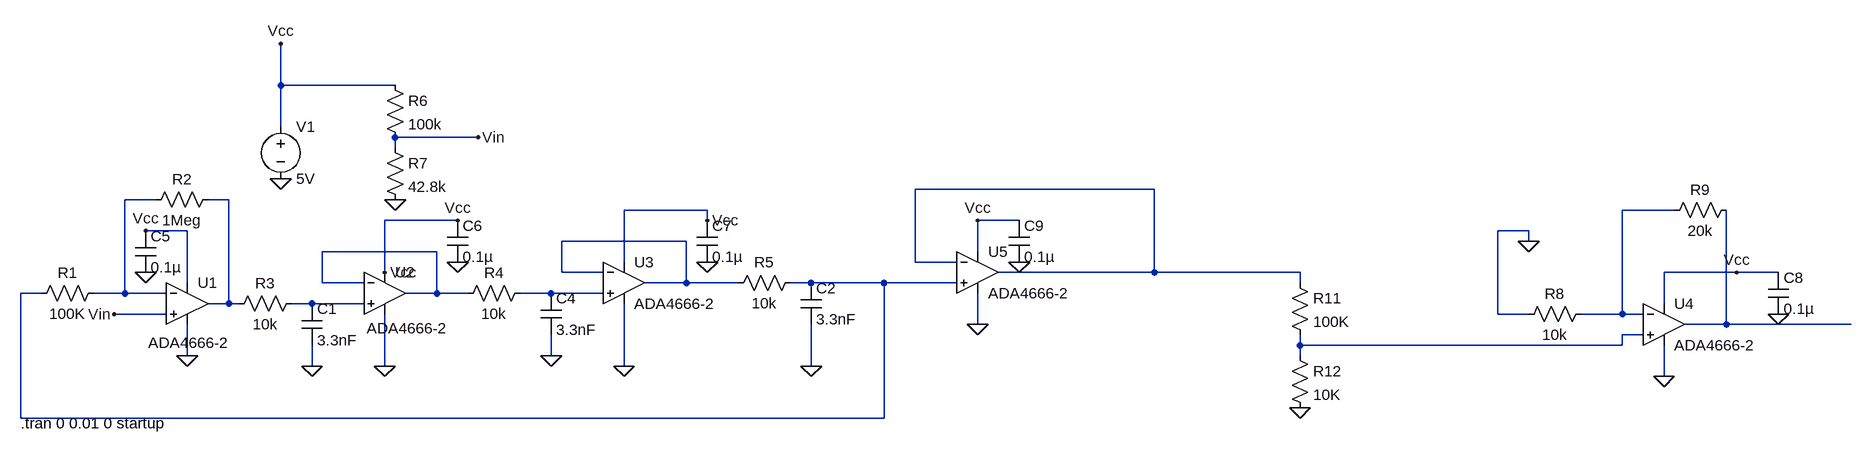
[diagram p0: schematic SINE_FINAL.asc]
SINE_FINAL.asc, the LTspice schematic file:
Version 4.1
SHEET 1 2704 692
WIRE -240 -336 -240 -400
WIRE -64 -336 -240 -336
WIRE -240 -272 -240 -336
WIRE 64 -256 -64 -256
WIRE -64 -240 -64 -256
WIRE 1104 -176 736 -176
WIRE -432 -160 -480 -160
WIRE -320 -160 -352 -160
WIRE 416 -144 288 -144
WIRE 1904 -144 1824 -144
WIRE 32 -128 -80 -128
WIRE 416 -128 416 -144
WIRE 896 -128 832 -128
WIRE -384 -112 -448 -112
WIRE 1680 -112 1632 -112
WIRE 384 -96 192 -96
WIRE 1680 -96 1680 -112
WIRE 0 -80 -176 -80
WIRE 832 -80 832 -128
WIRE 288 -64 288 -144
WIRE 736 -64 736 -176
WIRE 800 -64 736 -64
WIRE -80 -48 -80 -128
WIRE 192 -48 192 -96
WIRE 256 -48 192 -48
WIRE 1104 -48 1104 -176
WIRE 1104 -48 864 -48
WIRE 1328 -48 1104 -48
WIRE 2000 -48 1888 -48
WIRE 2064 -48 2000 -48
WIRE -384 -32 -384 -112
WIRE -176 -32 -176 -80
WIRE -112 -32 -176 -32
WIRE 384 -32 384 -96
WIRE 384 -32 320 -32
WIRE 464 -32 384 -32
WIRE 576 -32 544 -32
WIRE 688 -32 576 -32
WIRE 800 -32 688 -32
WIRE 1328 -32 1328 -48
WIRE -608 -16 -640 -16
WIRE -480 -16 -480 -160
WIRE -480 -16 -528 -16
WIRE -416 -16 -480 -16
WIRE 0 -16 0 -80
WIRE 0 -16 -48 -16
WIRE 48 -16 0 -16
WIRE 176 -16 128 -16
WIRE 256 -16 176 -16
WIRE -320 0 -320 -160
WIRE -320 0 -352 0
WIRE -304 0 -320 0
WIRE -192 0 -224 0
WIRE -112 0 -192 0
WIRE 1888 0 1888 -48
WIRE -416 16 -496 16
WIRE 1632 16 1632 -112
WIRE 1680 16 1632 16
WIRE 1824 16 1824 -144
WIRE 1824 16 1760 16
WIRE 1856 16 1824 16
WIRE 832 32 832 -16
WIRE 1984 32 1984 -144
WIRE 1984 32 1920 32
WIRE 2176 32 1984 32
WIRE 1856 48 1824 48
WIRE 1328 64 1328 48
WIRE 1824 64 1824 48
WIRE 1824 64 1328 64
WIRE -384 80 -384 32
WIRE 176 80 176 48
WIRE 1328 80 1328 64
WIRE -192 96 -192 64
WIRE -80 96 -80 16
WIRE 288 96 288 0
WIRE 576 96 576 32
WIRE 1888 112 1888 64
WIRE -640 176 -640 -16
WIRE 688 176 688 -32
WIRE 688 176 -640 176
FLAG -192 96 0
FLAG 176 80 0
FLAG 576 96 0
FLAG -384 80 0
FLAG -80 96 0
FLAG 288 96 0
FLAG -448 -112 Vcc
FLAG -80 -48 Vcc
FLAG -240 -192 0
FLAG -240 -400 Vcc
FLAG -64 -160 0
FLAG 64 -256 Vin
FLAG -496 16 Vin
FLAG -448 -48 0
FLAG 32 -128 Vcc
FLAG 32 -64 0
FLAG 416 -128 Vcc
FLAG 416 -64 0
FLAG 2000 -48 Vcc
FLAG 2064 16 0
FLAG 1888 112 0
FLAG 1328 160 0
FLAG 832 32 0
FLAG 832 -128 Vcc
FLAG 896 -64 0
FLAG 1680 -96 0
SYMBOL OpAmps\\ADA4666-2 -384 -64 R0
WINDOW 3 -60 124 Left 2
SYMATTR InstName U1
SYMBOL OpAmps\\ADA4666-2 -80 -80 R0
WINDOW 3 -28 118 Left 2
SYMATTR InstName U2
SYMBOL OpAmps\\ADA4666-2 288 -96 R0
SYMATTR InstName U3
SYMBOL res -512 -32 R90
WINDOW 0 0 56 VBottom 2
WINDOW 3 32 56 VTop 2
SYMATTR InstName R1
SYMATTR Value 100K
SYMBOL res -336 -176 R90
WINDOW 0 0 56 VBottom 2
WINDOW 3 32 56 VTop 2
SYMATTR InstName R2
SYMATTR Value 1Meg
SYMBOL res -208 -16 R90
WINDOW 0 0 56 VBottom 2
WINDOW 3 32 56 VTop 2
SYMATTR InstName R3
SYMATTR Value 10k
SYMBOL res 144 -32 R90
WINDOW 0 0 56 VBottom 2
WINDOW 3 32 56 VTop 2
SYMATTR InstName R4
SYMATTR Value 10k
SYMBOL cap -208 0 R0
SYMATTR InstName C1
SYMATTR Value 3.3nF
SYMBOL res 560 -48 R90
WINDOW 0 0 56 VBottom 2
WINDOW 3 32 56 VTop 2
SYMATTR InstName R5
SYMATTR Value 10k
SYMBOL voltage -240 -288 R0
WINDOW 123 0 0 Left 0
WINDOW 39 0 0 Left 0
SYMATTR InstName V1
SYMATTR Value 5V
SYMBOL res -80 -352 R0
SYMATTR InstName R6
SYMATTR Value 100k
SYMBOL res -80 -256 R0
SYMATTR InstName R7
SYMATTR Value 42.8k
SYMBOL cap 160 -16 R0
SYMATTR InstName C4
SYMATTR Value 3.3nF
SYMBOL cap 560 -32 R0
SYMATTR InstName C2
SYMATTR Value 3.3nF
SYMBOL cap -464 -112 R0
SYMATTR InstName C5
SYMATTR Value 0.1µ
SYMBOL cap 16 -128 R0
SYMATTR InstName C6
SYMATTR Value 0.1µ
SYMBOL cap 400 -128 R0
SYMATTR InstName C7
SYMATTR Value 0.1µ
SYMBOL OpAmps\\ADA4666-2 1888 -32 R0
SYMATTR InstName U4
SYMBOL res 1664 32 R270
WINDOW 0 32 56 VTop 2
WINDOW 3 0 56 VBottom 2
SYMATTR InstName R8
SYMATTR Value 10k
SYMBOL cap 2048 -48 R0
SYMATTR InstName C8
SYMATTR Value 0.1µ
SYMBOL res 1888 -128 R270
WINDOW 0 32 56 VTop 2
WINDOW 3 0 56 VBottom 2
SYMATTR InstName R9
SYMATTR Value 20k
SYMBOL res 1312 -48 R0
SYMATTR InstName R11
SYMATTR Value 100K
SYMBOL res 1312 64 R0
SYMATTR InstName R12
SYMATTR Value 10K
SYMBOL OpAmps\\ADA4666-2 832 -112 R0
SYMATTR InstName U5
SYMBOL cap 880 -128 R0
SYMATTR InstName C9
SYMATTR Value 0.1µ
TEXT -640 184 Left 2 !.tran 0 0.01 0 startup

The netlist it stands for:
* SINE_FINAL.asc
X§U1 Vin N002 Vcc 0 N003 ADA4666-2  ; pins In+ In- V+ V- OUT
X§U2 N009 N006 Vcc 0 N006 ADA4666-2  ; pins In+ In- V+ V- OUT
X§U3 N008 N005 Vcc 0 N005 ADA4666-2  ; pins In+ In- V+ V- OUT
R1 N002 N007 100K
R2 N003 N002 1Meg
R3 N009 N003 10k
R4 N008 N006 10k
C1 N009 0 3.3nF
R5 N007 N005 10k
V1 Vcc 0 5V
R6 Vcc Vin 100k
R7 Vin 0 42.8k
C4 N008 0 3.3nF
C2 N007 0 3.3nF
C5 Vcc 0 0.1µ
C6 Vcc 0 0.1µ
C7 Vcc 0 0.1µ
X§U4 N011 N004 Vcc 0 N010 ADA4666-2  ; pins In+ In- V+ V- OUT
R8 0 N004 10k
C8 Vcc 0 0.1µ
R9 N004 N010 20k
R11 N001 N011 100K
R12 N011 0 10K
X§U5 N007 N001 Vcc 0 N001 ADA4666-2  ; pins In+ In- V+ V- OUT
C9 Vcc 0 0.1µ
.tran 0 0.01 0 startup
.backanno
.end